# Altium schematic sheet Top_Sheet.SchDoc
size Letter; SheetNumber: 1; SheetTotal: 11
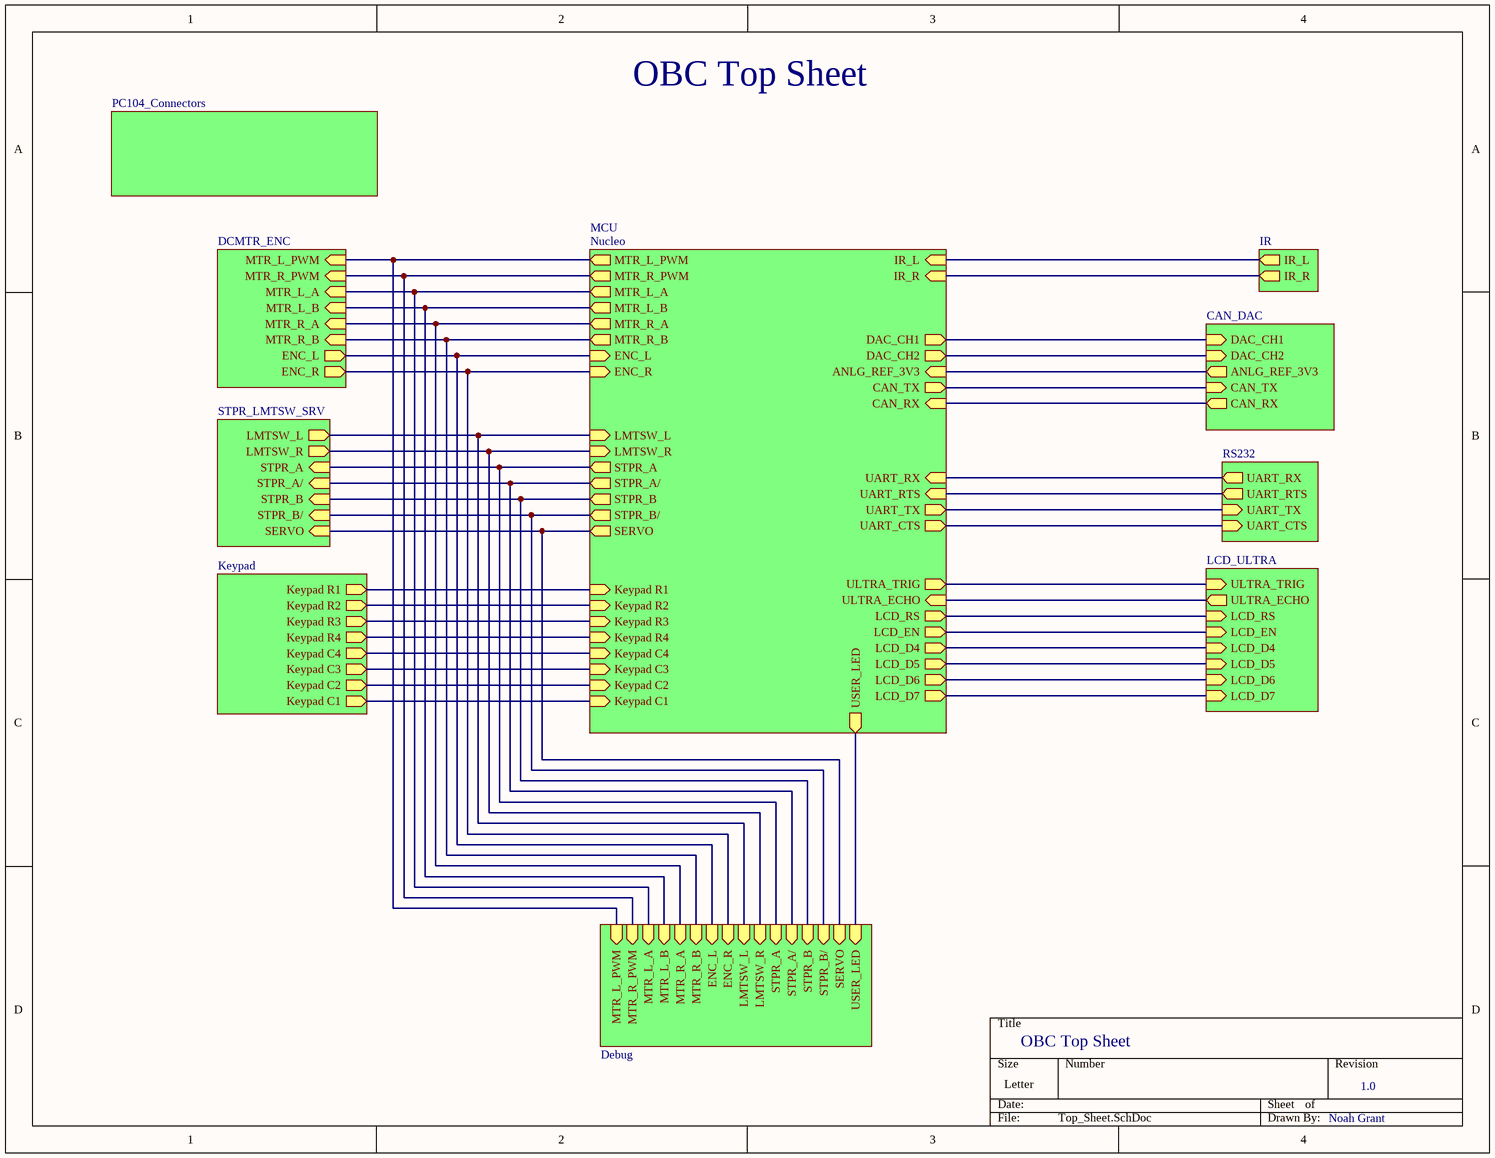
[diagram p0: Top_Sheet.SchDoc]

## Sub-sheets
Designator = DCMTR_ENC: MTR_L_PWM (in), MTR_R_PWM (in), MTR_L_A (in), MTR_L_B (in), MTR_R_A (in), MTR_R_B (in), ENC_L (out), ENC_R (out)
Designator = STPR_LMTSW_SRV: LMTSW_L (out), LMTSW_R (out), STPR_A (in), STPR_A/ (in), STPR_B (in), STPR_B/ (in), SERVO (in)
Designator = RS232: UART_RX (out), UART_RTS (out), UART_TX (in), UART_CTS (in)
Designator = CAN_DAC: DAC_CH1 (in), DAC_CH2 (in), ANLG_REF_3V3 (out), CAN_TX (in), CAN_RX (out)
Designator = IR: IR_L (out), IR_R (out)
Designator = LCD_ULTRA: ULTRA_TRIG (in), ULTRA_ECHO (out), LCD_RS (in), LCD_EN (in), LCD_D4 (in), LCD_D5 (in), LCD_D6 (in), LCD_D7 (in)
Designator = Debug: ENC_L (in), ENC_R (in), MTR_L_PWM (in), MTR_R_PWM (in), MTR_L_A (in), MTR_L_B (in), MTR_R_A (in), MTR_R_B (in), STPR_A (in), STPR_A/ (in), STPR_B (in), STPR_B/ (in), SERVO (in), LMTSW_L (in), LMTSW_R (in), USER_LED (in)
Designator = PC104_Connectors: no entries
Designator = Keypad: Keypad R1 (out), Keypad R2 (out), Keypad R3 (out), Keypad R4 (out), Keypad C4 (out), Keypad C3 (out), Keypad C2 (out), Keypad C1 (out)
MCU = Nucleo: MTR_L_PWM (out), MTR_L_A (out), USER_LED (out), MTR_L_B (out), STPR_B (out), STPR_B/ (out), MTR_R_PWM (out), DAC_CH1 (out), STPR_A/ (out), STPR_A (out), MTR_R_B (out), CAN_RX (in), CAN_TX (out), ANLG_REF_3V3 (in), DAC_CH2 (out), LCD_RS (out), LCD_EN (out), ULTRA_ECHO (in), LCD_D5 (out), LCD_D4 (out), UART_TX (out), LCD_D6 (out), MTR_R_A (out), LMTSW_R (in), LMTSW_L (in), ULTRA_TRIG (out), LCD_D7 (out), UART_RX (in), SERVO (out), UART_CTS (out), UART_RTS (in), ENC_L (in), ENC_R (in), Keypad R1 (in), Keypad R2 (in), Keypad R3 (in), Keypad R4 (in), Keypad C4 (in), Keypad C3 (in), Keypad C2 (in), Keypad C1 (in), IR_L (in), IR_R (in)

## Nets
(unnamed): sheet MCU/MTR_L_PWM, sheet Designator/MTR_L_PWM, sheet Designator/MTR_L_PWM
(unnamed): sheet MCU/MTR_L_A, sheet Designator/MTR_L_A, sheet Designator/MTR_L_A
(unnamed): sheet MCU/USER_LED, sheet Designator/USER_LED
(unnamed): sheet MCU/MTR_L_B, sheet Designator/MTR_L_B, sheet Designator/MTR_L_B
(unnamed): sheet MCU/STPR_B, sheet Designator/STPR_B, sheet Designator/STPR_B
(unnamed): sheet MCU/STPR_B/, sheet Designator/STPR_B/, sheet Designator/STPR_B/
(unnamed): sheet MCU/MTR_R_PWM, sheet Designator/MTR_R_PWM, sheet Designator/MTR_R_PWM
(unnamed): sheet MCU/DAC_CH1, sheet Designator/DAC_CH1
(unnamed): sheet MCU/STPR_A/, sheet Designator/STPR_A/, sheet Designator/STPR_A/
(unnamed): sheet MCU/STPR_A, sheet Designator/STPR_A, sheet Designator/STPR_A
(unnamed): sheet MCU/MTR_R_B, sheet Designator/MTR_R_B, sheet Designator/MTR_R_B
(unnamed): sheet MCU/CAN_RX, sheet Designator/CAN_RX
(unnamed): sheet MCU/CAN_TX, sheet Designator/CAN_TX
(unnamed): sheet MCU/ANLG_REF_3V3, sheet Designator/ANLG_REF_3V3
(unnamed): sheet MCU/DAC_CH2, sheet Designator/DAC_CH2
(unnamed): sheet MCU/LCD_RS, sheet Designator/LCD_RS
(unnamed): sheet MCU/LCD_EN, sheet Designator/LCD_EN
(unnamed): sheet MCU/ULTRA_ECHO, sheet Designator/ULTRA_ECHO
(unnamed): sheet MCU/LCD_D5, sheet Designator/LCD_D5
(unnamed): sheet MCU/LCD_D4, sheet Designator/LCD_D4
(unnamed): sheet MCU/UART_TX, sheet Designator/UART_TX
(unnamed): sheet MCU/LCD_D6, sheet Designator/LCD_D6
(unnamed): sheet MCU/MTR_R_A, sheet Designator/MTR_R_A, sheet Designator/MTR_R_A
(unnamed): sheet MCU/LMTSW_R, sheet Designator/LMTSW_R, sheet Designator/LMTSW_R
(unnamed): sheet MCU/LMTSW_L, sheet Designator/LMTSW_L, sheet Designator/LMTSW_L
(unnamed): sheet MCU/ULTRA_TRIG, sheet Designator/ULTRA_TRIG
(unnamed): sheet MCU/LCD_D7, sheet Designator/LCD_D7
(unnamed): sheet MCU/UART_RX, sheet Designator/UART_RX
(unnamed): sheet MCU/SERVO, sheet Designator/SERVO, sheet Designator/SERVO
(unnamed): sheet MCU/UART_CTS, sheet Designator/UART_CTS
(unnamed): sheet MCU/UART_RTS, sheet Designator/UART_RTS
(unnamed): sheet MCU/ENC_L, sheet Designator/ENC_L, sheet Designator/ENC_L
(unnamed): sheet MCU/ENC_R, sheet Designator/ENC_R, sheet Designator/ENC_R
(unnamed): sheet MCU/Keypad R1, sheet Designator/Keypad R1
(unnamed): sheet MCU/Keypad R2, sheet Designator/Keypad R2
(unnamed): sheet MCU/Keypad R3, sheet Designator/Keypad R3
(unnamed): sheet MCU/Keypad R4, sheet Designator/Keypad R4
(unnamed): sheet MCU/Keypad C4, sheet Designator/Keypad C4
(unnamed): sheet MCU/Keypad C3, sheet Designator/Keypad C3
(unnamed): sheet MCU/Keypad C2, sheet Designator/Keypad C2
(unnamed): sheet MCU/Keypad C1, sheet Designator/Keypad C1
(unnamed): sheet MCU/IR_L, sheet Designator/IR_L
(unnamed): sheet MCU/IR_R, sheet Designator/IR_R

## Notes on the sheet
- OBC Top Sheet
- 1.0
- Noah Grant